# Altium schematic sheet PD_MK2.SchDoc: Sample Sheet Title
size B; Date: MM/DD/YYYY; Author: Sample Author; Organization: ORGANIZATION; Address1: ADDRESS 1; Address2: ADDRESS 2; Address3: ADDRESS 3; Address4: ADDRESS 4; Revision: -; SheetNumber: 1; SheetTotal: 2; ENG_APP_DATE: --/--/--; DSN_APP_DATE: --/--/--; CHK_APP_DATE: --/--/--
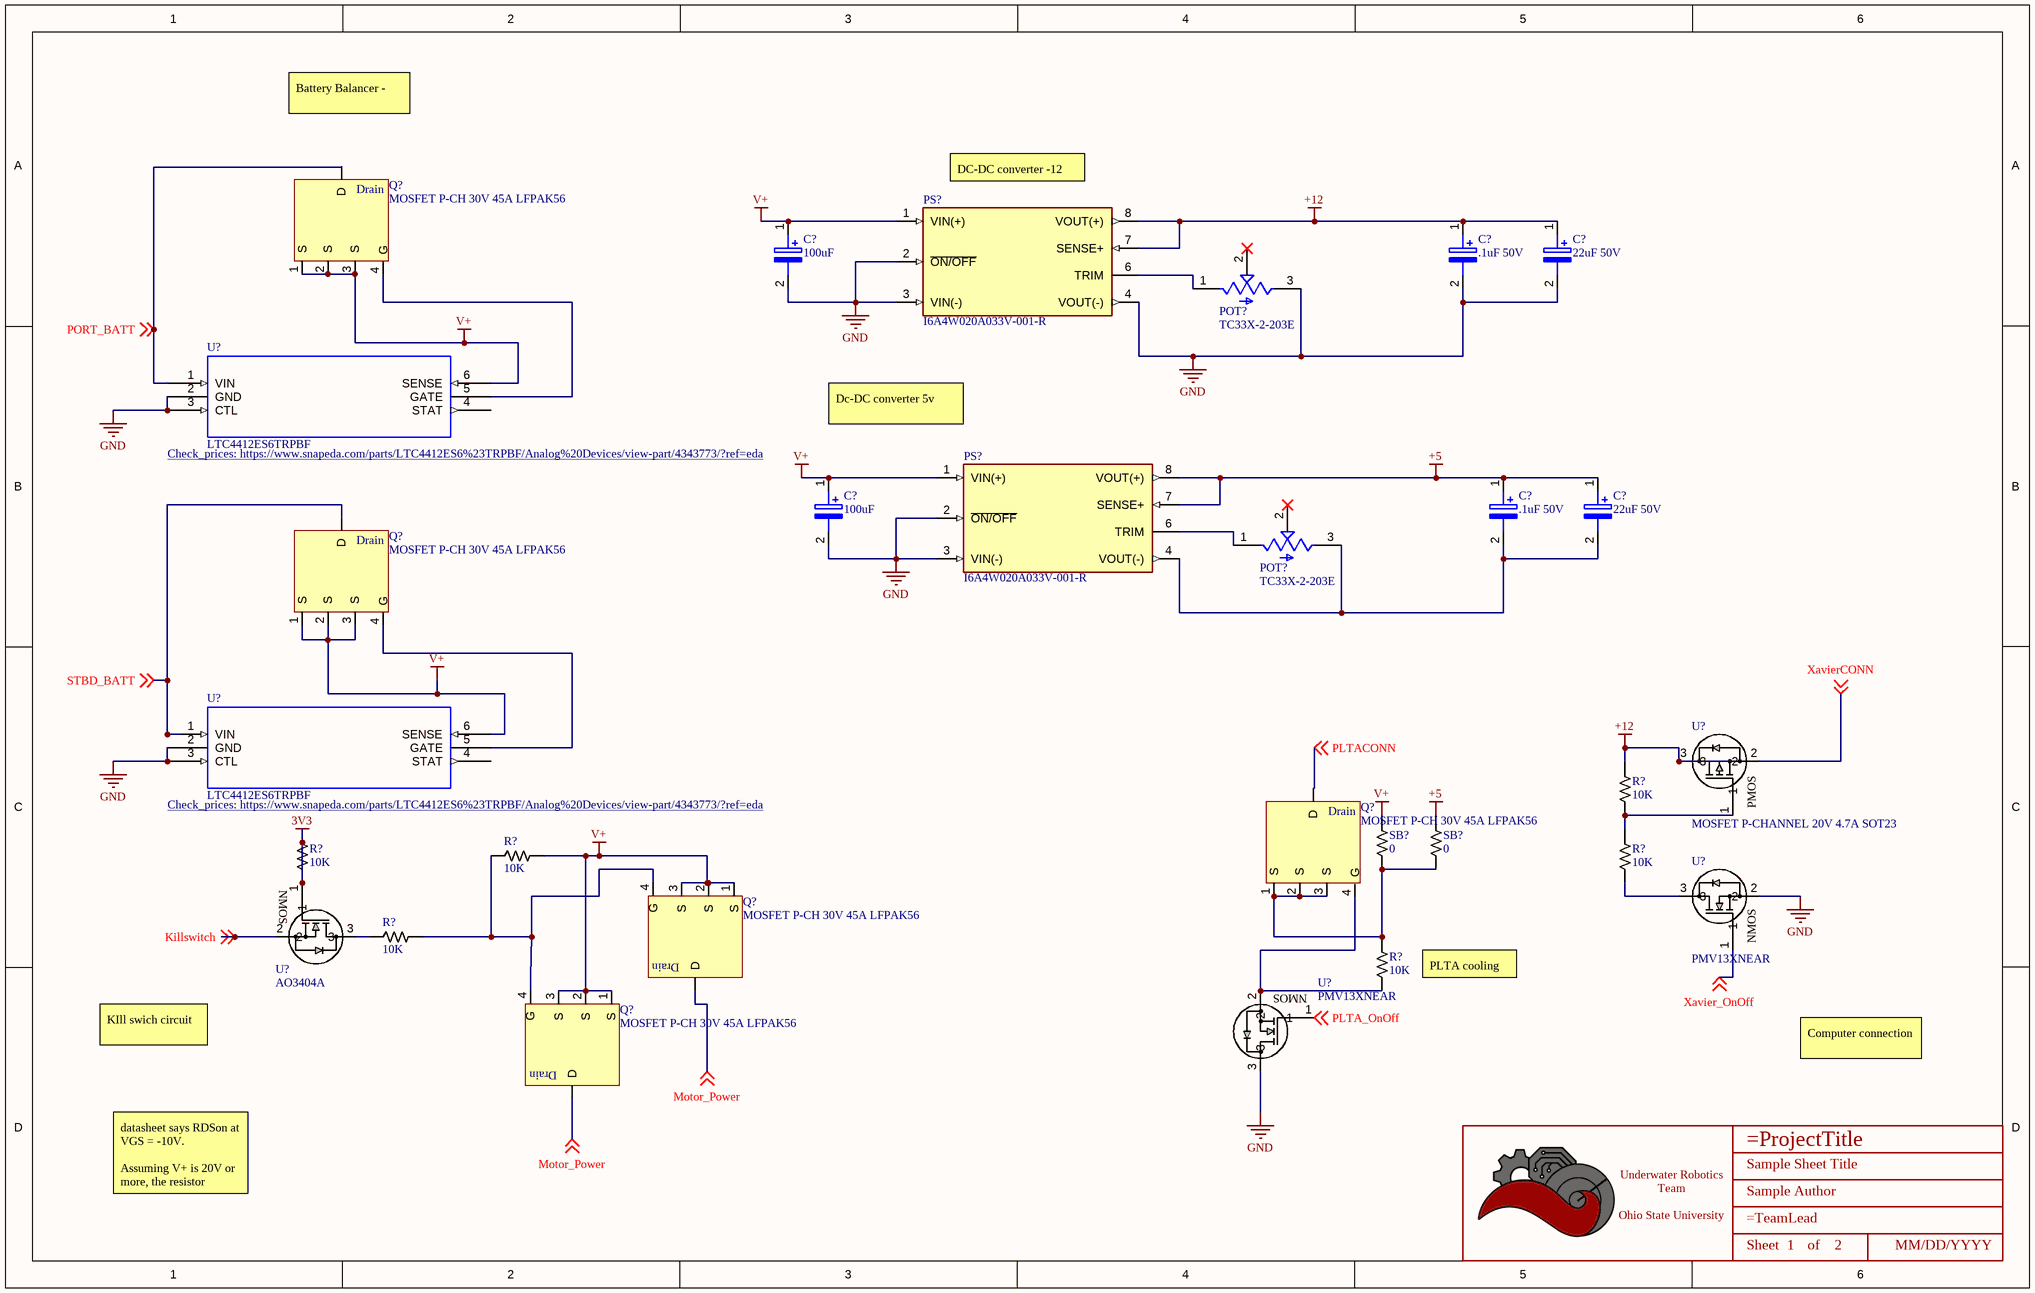
[diagram p0: PD_MK2.SchDoc]

## Parts
(Parts that share a designator on the sheet are numbered #1, #2 ... from top to bottom, then left to right.)
*  Title_Block  [LOGO]  (value not drawn)  (graphical)
C?#1  100uF  [CAPAE430X550N]
C?#2  .1uF 50V  [CAPAE430X550N]
C?#3  22uF 50V  [CAPAE430X550N]
C?#4  100uF  [CAPAE430X550N]
C?#5  .1uF 50V  [CAPAE430X550N]
C?#6  22uF 50V  [CAPAE430X550N]
POT?#1  TC33X-2-203E  [TRIM_TC33X-2-203E]
POT?#2  TC33X-2-203E  [TRIM_TC33X-2-203E]
PS?#1  I6A4W020A033V-001-R  [CONV_I6A4W020A033V-001-R]
PS?#2  I6A4W020A033V-001-R  [CONV_I6A4W020A033V-001-R]
Q?#1  MOSFET P-CH 30V 45A LFPAK56  [TRANS_PSMN5R5-60YS,115]
Q?#2  MOSFET P-CH 30V 45A LFPAK56  [TRANS_PSMN5R5-60YS,115]
Q?#3  MOSFET P-CH 30V 45A LFPAK56  [TRANS_PSMN5R5-60YS,115]
Q?#4  MOSFET P-CH 30V 45A LFPAK56  [TRANS_PSMN5R5-60YS,115]
Q?#5  MOSFET P-CH 30V 45A LFPAK56  [TRANS_PSMN5R5-60YS,115]
R?#1  Value  (Ohms): 10K  [RESISTOR_0603]  (hidden comment: 10k Ohm 5% 1/10W)
R?#2  Value  (Ohms): 10K  [RESISTOR_0603]  (hidden comment: 10k Ohm 5% 1/10W)
R?#3  Value  (Ohms): 10K  [RESISTOR_0603]  (hidden comment: 10k Ohm 5% 1/10W)
R?#4  Value  (Ohms): 10K  [RESISTOR_0603]  (hidden comment: 10k Ohm 5% 1/10W)
R?#5  Value  (Ohms): 10K  [RESISTOR_0603]  (hidden comment: 10k Ohm 5% 1/10W)
R?#6  Value  (Ohms): 10K  [RESISTOR_0603]  (hidden comment: 10k Ohm 5% 1/10W)
SB?#1  Value  (Ohms): 0  [RESISTOR_0603]  (hidden comment: 0 Ohm Jumper No Fit)
SB?#2  Value  (Ohms): 0  [RESISTOR_0603]  (hidden comment: 0 Ohm Jumper No Fit)
U?#1  LTC4412ES6TRPBF  [TSOT-23_S6]
U?#2  LTC4412ES6TRPBF  [TSOT-23_S6]
U?#3  MOSFET P-CHANNEL 20V 4.7A SOT23  [SOT-23-3]
U?#4  AO3404A  [SOT-23-3]
U?#5  PMV13XNEAR  [SOT-23-3]
U?#6  PMV13XNEAR  [SOT-23-3]

## Nets
3V3: R?#2.1 R?#2.2 U?#4.1
+5: C?#5.1(POS) C?#6.1(POS) PS?#2.7(SENSE+) PS?#2.8(VOUT(+)) SB?#2.1
+12: C?#2.1(POS) C?#3.1(POS) PS?#1.7(SENSE+) PS?#1.8(VOUT(+)) R?#1.1 U?#3.3
GND: C?#1.2(NEG) C?#2.2(NEG) C?#3.2(NEG) C?#4.2(NEG) POT?#1.3(CW) PS?#1.2(~{ON/OFF}) PS?#1.3(VIN(-)) PS?#1.4(VOUT(-)) PS?#2.2(~{ON/OFF}) PS?#2.3(VIN(-)) U?#1.2(GND) U?#1.3(CTL) U?#2.2(GND) U?#2.3(CTL) U?#5.2 U?#6.3
V+: C?#1.1(POS) C?#4.1(POS) PS?#1.1(VIN(+)) PS?#2.1(VIN(+)) Q?#1.1(S) Q?#1.2(S) Q?#1.3(S) Q?#2.1(S) Q?#2.2(S) Q?#2.3(S) Q?#4.1(S) Q?#4.2(S) Q?#4.3(S) Q?#5.1(S) Q?#5.2(S) Q?#5.3(S) R?#3.1 SB?#1.1 U?#1.6(SENSE) U?#2.6(SENSE)
Killswitch: U?#4.2 ; off-sheet Killswitch
Motor_Power: Q?#4.5(D) Q?#5.5(D) ; off-sheet Motor_Power
PLTA_OnOff: U?#6.1 ; off-sheet PLTA_OnOff
PLTACONN: Q?#3.5(D) ; off-sheet PLTACONN
PORT_BATT: Q?#1.5(D) U?#1.1(VIN) ; off-sheet PORT_BATT
STBD_BATT: Q?#2.5(D) U?#2.1(VIN) ; off-sheet STBD_BATT
Xavier_OnOff: U?#5.1 ; off-sheet Xavier_OnOff
XavierCONN: U?#3.2 ; off-sheet XavierCONN
NetC?#5_2: C?#5.2(NEG) C?#6.2(NEG) POT?#2.3(CW) PS?#2.4(VOUT(-))
NetPOT?#1_1: POT?#1.1(CCW) PS?#1.6(TRIM)
NetPOT?#2_1: POT?#2.1(CCW) PS?#2.6(TRIM)
NetQ?#1_4: Q?#1.4(G) U?#1.5(GATE)
NetQ?#2_4: Q?#2.4(G) U?#2.5(GATE)
NetQ?#3_1: Q?#3.1(S) Q?#3.2(S) Q?#3.3(S) R?#6.1 SB?#1.2 SB?#2.2
NetQ?#3_4: Q?#3.4(G) R?#6.2 U?#6.2
NetQ?#4_4: Q?#4.4(G) Q?#5.4(G) R?#3.2 R?#5.1
NetR?#1_2: R?#1.2 R?#4.1 U?#3.1
NetR?#4_2: R?#4.2 U?#5.3
NetR?#5_2: R?#5.2 U?#4.3

Not connected (* = marked no-connect by the designer): POT?#1 2(W)*; POT?#2 2(W)*; U?#1 4(STAT); U?#2 4(STAT)

## Notes on the sheet
- Battery Balancer -
- (near PS?#1) DC-DC converter -12
- Dc-DC converter 5v
- (near R?#6) PLTA cooling
- KIll swich circuit
- Computer connection
- datasheet says RDSon at VGS = -10V.
  Assuming V+ is 20V or more, the resistor divider will make Vg 10 V which would mean VGS is -10V
- DWG. NO.
- REV.
- SHT.
- THIS DOCUMENT AND THE DATA DISCLOSED HEREIN OR HEREWITH IS THE PROPERTY OF ALTIUM LIMITED AND MAY BE FREELY DISTRIBUTED IN WHOLE. NO RIGHTS ARE RESERVED OR EXPRESS OR IMPLIED WARANTEE GIVEN.
- REVISION
- DESCRIPTION
- DATE
- APPROVED
- ENG:
- APPROVALS
- PROJECT
- DSN:
- CHK:
- REFERENCE DOCUMENTS
- PROJECT REVISION:
- TITLE
- DOCUMENT REVISION:
- DESIGN ITEM:
- BOM:
- FAB DWG:
- PCB DWG:
- ASSY DWG:
- SCALE:
- SIZE
- B
- CAGE CODE
- FILE NAME
- DWG NO.
- SHEET
- OF
- REV
- (in symbol AO3404A) NMOS
- (in symbol BUK6Y19-30PX) Drain
- (in symbol PMV13XNEAR) NMOS
- (in symbol Title_Block) Underwater Robotics Team / Ohio State University; Sheet; of
- (in symbol TSM500P02CX) PMOS

## Library data of the parts
* = Title_Block: UWRT Schematic Title Block Template / Created June 2021, Dylan Trainor
C?#1-C?#6 = 865250340002: 4.7ÂµF 16V Aluminum Electrolytic Capacitors Radial, Can - SMD 2000 Hrs @ 85Â°C; MF: Wurth Elektronik; Value: *; SnapEDA_Link: https://www.snapeda.com/parts/865250340002/W%C3%BCrth%20Elektronik/view-part/5002976/?ref=snap; MP: 865250340002; Purchase-URL: https://pricing.snapeda.com/search/part/865250340002/?ref=eda; Check_prices: https://www.snapeda.com/parts/865250340002/W%C3%BCrth%20Elektronik/view-part/5002976/?ref=eda; Availability: Warning; Price: None; Package: None
POT?#1 POT?#2 = TC33X-2-203E: 20 kOhms 0.1W, 1/10W J Lead Surface Mount Trimmer Potentiometer Cermet 1 Turn Top Adjustment; MF: Bourns; Value: *; SnapEDA_Link: https://www.snapeda.com/parts/TC33X-2-203E/Bourns/view-part/312812/?ref=snap; Check_prices: https://www.snapeda.com/parts/TC33X-2-203E/Bourns/view-part/312812/?ref=eda; Digi-Key_Part_Number: TC33X-2-203ECT-ND; Purchase-URL: https://pricing.snapeda.com/search/part/TC33X-2-203E/?ref=eda; Package: 1608 Bourns; MP: TC33X-2-203E
PS?#1 PS?#2 = I6A4W020A033V-001-R: Non-Isolated PoL Module DC DC Converter 1 Output 3.3 ~ 15V 20A 9V - 53V Input; MF: TDK-Lambda Americas; Availability: In Stock; Price: None; Package: DIP-8 TDK-Lambda; MP: I6A4W020A033V-001-R; Value: *; SnapEDA_Link: https://www.snapeda.com/parts/I6A4W020A033V-001-R/TDK-Lambda%20Americas%20Inc./view-part/1737324/?ref=snap; Check_prices: https://www.snapeda.com/parts/I6A4W020A033V-001-R/TDK-Lambda%20Americas%20Inc./view-part/1737324/?ref=eda; Purchase-URL: https://pricing.snapeda.com/search/part/I6A4W020A033V-001-R/?ref=eda
Q?#1-Q?#5 = BUK6Y19-30PX: P-Channel 30 V 45A (Ta) 66W (Ta) Surface Mount LFPAK56, Power-SO8
R?#1-R?#6 = RESISTOR_10K_0603: RES 10k OHM 5% 1/10W 0603; Tolerance: +/- 5%; Wattage: 1/8W; Made By: Robert Pafford; ComponentLink1Description: Datasheet; ComponentLink1URL: https://www.bourns.com/docs/product-datasheets/CRxxxxx.pdf; Supplier: Digikey; Digikey Part Numer: CR0603-JW-104ELFTR-ND; Supplier 1: Digi-Key; Supplier Part Number 1: 2019-RK73B1JTTD103JCT-ND
SB?#1 SB?#2 = JUMPER_0_0603: 0 Ohm Jumper No Fit for Solder Bridge; Made By: Robert Pafford; ComponentLink1Description: Digikey; ComponentLink1URL: https://www.digikey.com/en/products/detail/koa-speer-electronics-inc/RK73B1JTTD101J/9844701
U?#1 U?#2 = LTC4412ES6TRPBF: OR Controller Source Selector Switch P-Channel 2:1 TSOT-23-6; MP: LTC4412ES6#TRPBF; MF: Analog Devices; Price: None; Availability: Good; Mouser-Purchase-URL: https://snapeda.com/shop?store=Mouser&id=4343773; Arrow_Europe-Purchase-URL: https://snapeda.com/shop?store=Arrow+Europe&id=4343773; DigiKey-Purchase-URL: https://snapeda.com/shop?store=DigiKey&id=4343773; Package: SOT-23-6 Analog Devices; SnapEDA_Link: https://www.snapeda.com/parts/LTC4412ES6%23TRPBF/Analog%20Devices/view-part/4343773/?ref=snap; Value: *; Check_prices: https://www.snapeda.com/parts/LTC4412ES6%23TRPBF/Analog%20Devices/view-part/4343773/?ref=eda
U?#3 = TSM500P02CX: P-Channel 20 V 4.7A (Tc) 1.56W (Tc) Surface Mount SOT-23; Vendor: Taiwan Semiconductor Corporation; Vgs (Max): ±10V; Vgs (th): 800mV @ 250µA; Rds (on): 50mOhm @ 3A, 4.5V; Amp Rating: 4.7 A; FET Type: P-Channel; Package: TO-236-3, SC-59, SOT-23-3; Manufacturer_Part_Number: TSM500P02CX; Vdss: 20 V; Power Dissipation: 1.56W (Tc); Created By: Robert Pafford; Supplier 1: Digi-Key; Supplier Part Number 1: TSM500P02CXRFGCT-ND
U?#4 = AO3404A: N-Channel 30 V 5.8A (Ta) 1.4W (Ta) Surface Mount SOT-23-3; Vendor: Alpha & Omega Semiconductor Inc.; SourceLibrary: ON_Semiconductor_2020-01-13; Vgs (Max): 3V @ 5.8A, 10V; Vgs (th): 3V @ 250µA; Vdss: 30V; Rds (on): 28mOhm @ 5.8A, 10V; Amp Rating: 5.8 A; FET Type: N-Channel; Package: SOT23-3L; Manufacturer _Part_Number: AO3404A; Power Dissipation: 1.4W (Ta); Supplier 1: Digi-Key; Supplier Part Number 1: 785-1004-1-ND; Created By: Dylan T
U?#5 U?#6 = PMV13XNEAR: N-Channel 20 V 7.3A (Ta) 610mW (Ta), 8.3W (Tc) Surface Mount TO-236AB; Vendor: Nexperia USA Inc.; SourceLibrary: ON_Semiconductor_2020-01-13; Vgs (Max): +/- 12 V; Vgs (th): 1.3V @ 250uA; Vdss: 20 V; Rds (on): 15mOhm @ 7.3A, 8V; Amp Rating: 7.3 A; FET Type: N-Channel; Package: SOT23-3L; Manufacturer _Part_Number: PMV13XNEAR; Power Dissipation: 610mW (Ta), 8.3W (Tc); Created By: Dylan T; Supplier 1: Mouser; Supplier Part Number 1: 771-PMV13XNEAR